# EAGLE design ardunio_breakout (EAGLE 6.4)
AUTHOR: Pat Pannuto; REV: A; TITLE: Signpost Arduino Breakout
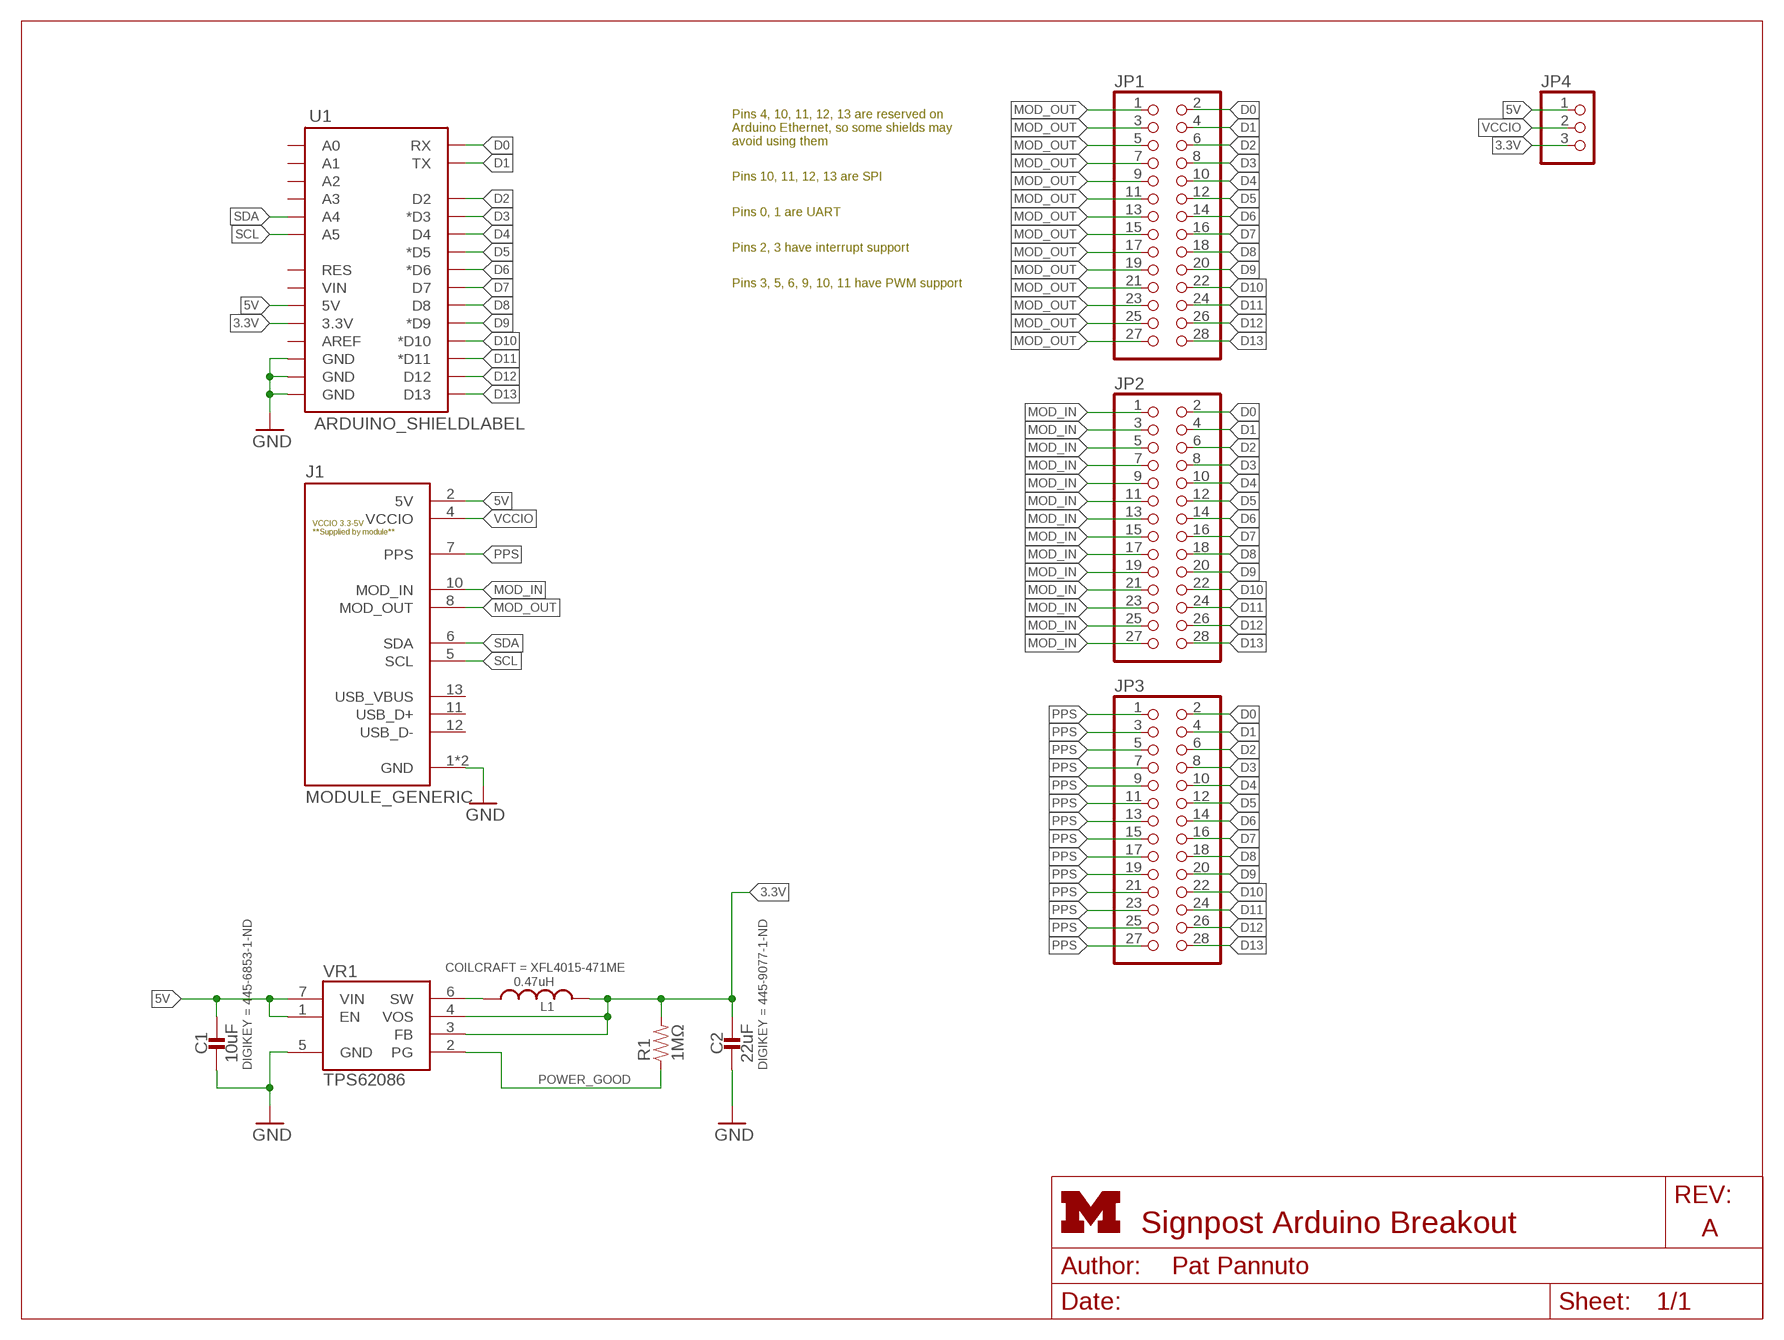
[diagram p0: schematic, sheet 1]
FRAME1 (LETTER_L_UMICH): HEIGHT: 8.5in; WIDTH: 11in

## Parts
C1  10uF  CAPACITOR0603_CAP  [0603_CAP]
C2  22uF  CAPACITOR0603_CAP  [0603_CAP]
J1  MODULE_GENERIC  [MODULE_GENERIC]
JP1  PINHD-2X14  [2X14]
JP2  PINHD-2X14  [2X14]
JP3  PINHD-2X14  [2X14]
JP4  PINHD-1X3  [1X03]
L1  0.47uH  INDUCTORXFL4015  [XFL4015]
R1  1MΩ  RESISTOR0603_RES  [0603-RES]
U1  ARDUINO_SHIELDLABEL  [DUEMILANOVE_SHIELD]
VR1  TPS62086  [RLT0007A]

## Nets
3.3V: C2.1 JP4.3 L1.2 R1.2 U1.3.3V VR1.3(FB) VR1.4(VOS)
5V: C1.1 J1.2(5V) JP4.1 U1.5V VR1.1(EN) VR1.7(VIN)
D0: JP1.2 JP2.2 JP3.2 U1.RX
D1: JP1.4 JP2.4 JP3.4 U1.TX
D2: JP1.6 JP2.6 JP3.6 U1.D2
D3: JP1.8 JP2.8 JP3.8 U1.D3(*D3)
D4: JP1.10 JP2.10 JP3.10 U1.D4
D5: JP1.12 JP2.12 JP3.12 U1.D5(*D5)
D6: JP1.14 JP2.14 JP3.14 U1.D6(*D6)
D7: JP1.16 JP2.16 JP3.16 U1.D7
D8: JP1.18 JP2.18 JP3.18 U1.D8
D9: JP1.20 JP2.20 JP3.20 U1.D9(*D9)
D10: JP1.22 JP2.22 JP3.22 U1.D10(*D10)
D11: JP1.24 JP2.24 JP3.24 U1.D11(*D11)
D12: JP1.26 JP2.26 JP3.26 U1.D12
D13: JP1.28 JP2.28 JP3.28 U1.D13
GND: C1.2 C2.2 J1.1(GND) J1.14(GND) U1.GND@0(GND) U1.GND@1(GND) U1.GND@2(GND) VR1.5(GND)
MOD_IN: J1.10(MOD_IN) JP2.1
MOD_OUT: J1.8(MOD_OUT) JP1.1 JP1.3 JP1.5 JP1.7 JP1.9 JP1.11 JP1.13 JP1.15 JP1.17 JP1.19 JP1.21 JP1.23 JP1.25 JP1.27
N$1: L1.1 VR1.6(SW)
POWER_GOOD: R1.1 VR1.2(PG)
PPS: J1.7(PPS) JP3.1
SCL: J1.5(SCL) U1.A5
SDA: J1.6(SDA) U1.A4
VCCIO: J1.4(VCCIO) JP4.2
Unconnected: J1.11(USB_D+) J1.12(USB_D-) J1.13(USB_VBUS) JP2.3 JP2.5 JP2.7 JP2.9 JP2.11 JP2.13 JP2.15 JP2.17 JP2.19 JP2.21 JP2.23 JP2.25 JP2.27 JP3.3 JP3.5 JP3.7 JP3.9 JP3.11 JP3.13 JP3.15 JP3.17 JP3.19 JP3.21 JP3.23 JP3.25 JP3.27 U1.A0 U1.A1 U1.A2 U1.A3 U1.AREF U1.RES U1.VIN

## Notes on the sheet
- Pins 4, 10, 11, 12, 13 are reserved on
  Arduino Ethernet, so some shields may
  avoid using them
- Pins 10, 11, 12, 13 are SPI
- Pins 0, 1 are UART
- Pins 2, 3 have interrupt support
- Pins 3, 5, 6, 9, 10, 11 have PWM support

## Library data of the parts
C1 = passives:CAPACITOR: 0402 Capacitor; DIGIKEY: 445-6853-1-ND
C2 = passives:CAPACITOR: 0402 Capacitor; DIGIKEY: 445-9077-1-ND
J1 = signpost:MODULE_GENERIC: Module header and PCB guildes for signposts; DIGIKEY: S9170-ND
JP1-JP3 = pinhead:PINHD-2X14: PIN HEADER
JP4 = pinhead:PINHD-1X3: PIN HEADER
L1 = passives:INDUCTOR: A very specific inductor; COILCRAFT: XFL4015-471ME
R1 = passives:RESISTOR: Resistor Basic schematic elements and footprints for 0603, 1206, and PTH resistors.
U1 = SparkFun-Boards:ARDUINO_SHIELD: Arduino shield footprint
VR1 = regulators:TPS62086: Buck Switching Regulator IC Positive Fixed 3.3V 1 Output 3A 7-VFDFN; DIGIKEY: 296-40831-1-ND

## Board
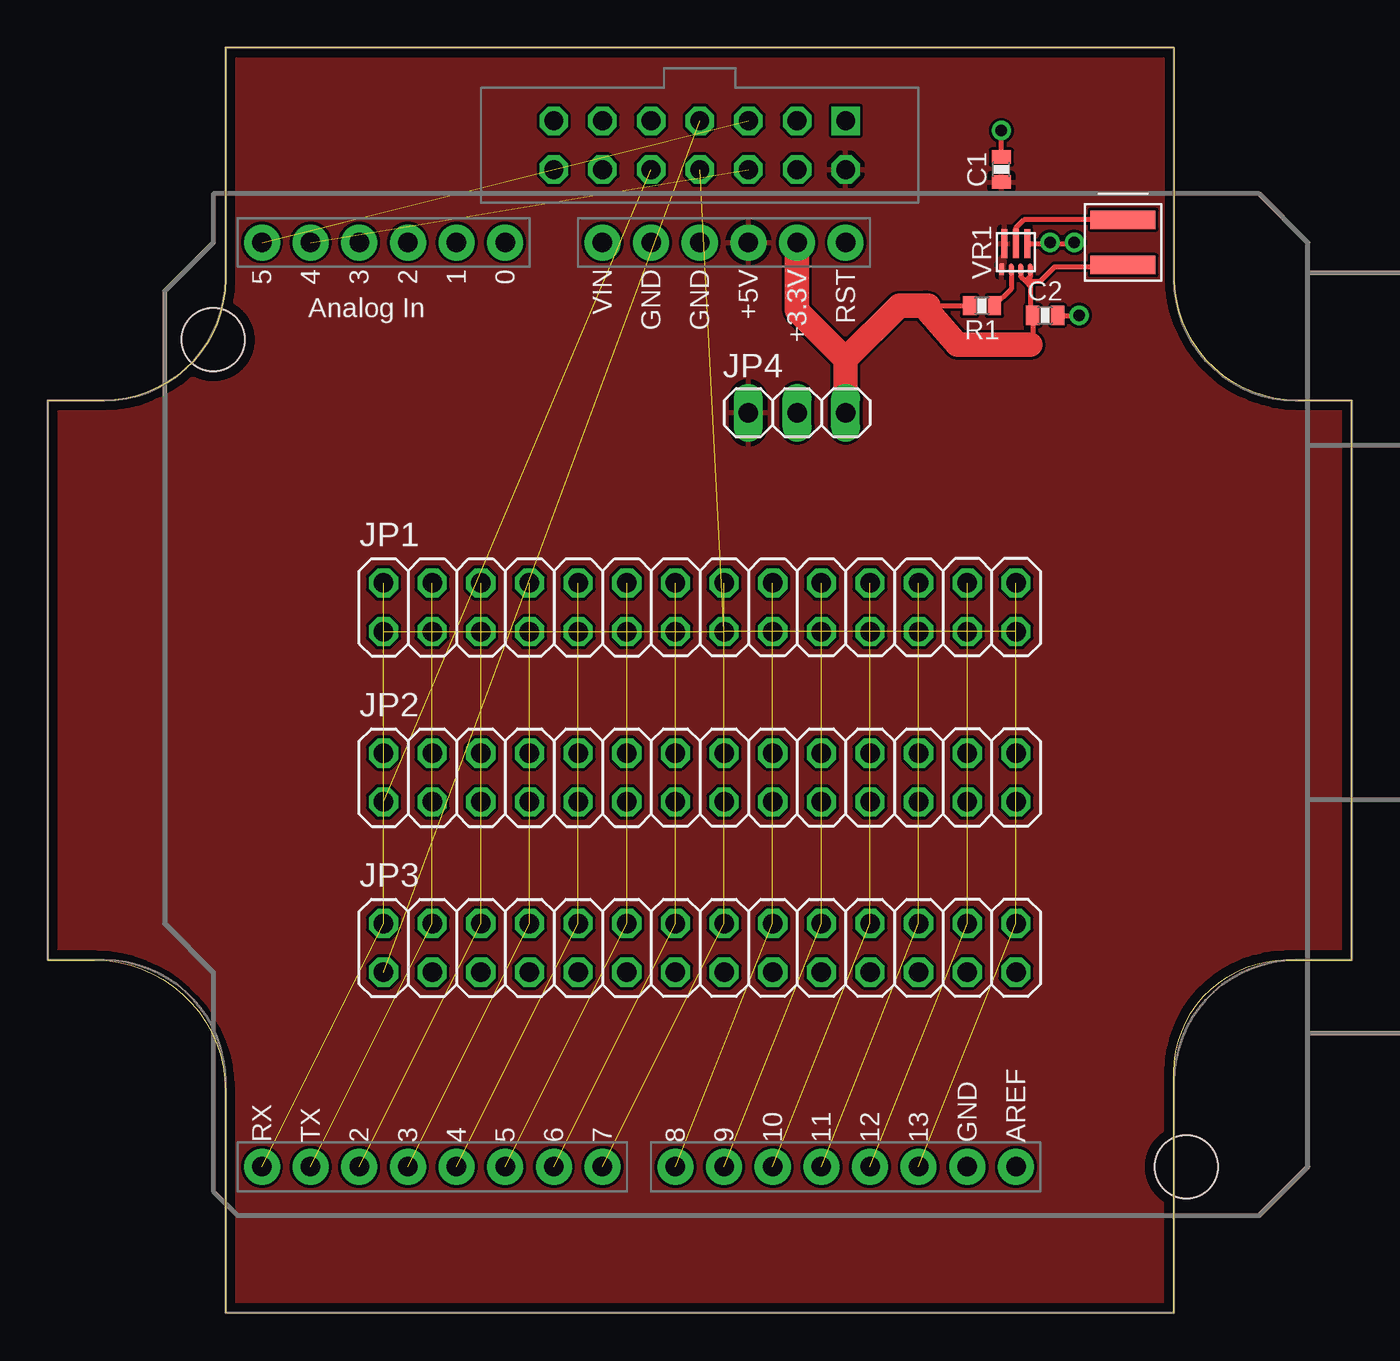
[diagram p1: board, top side]
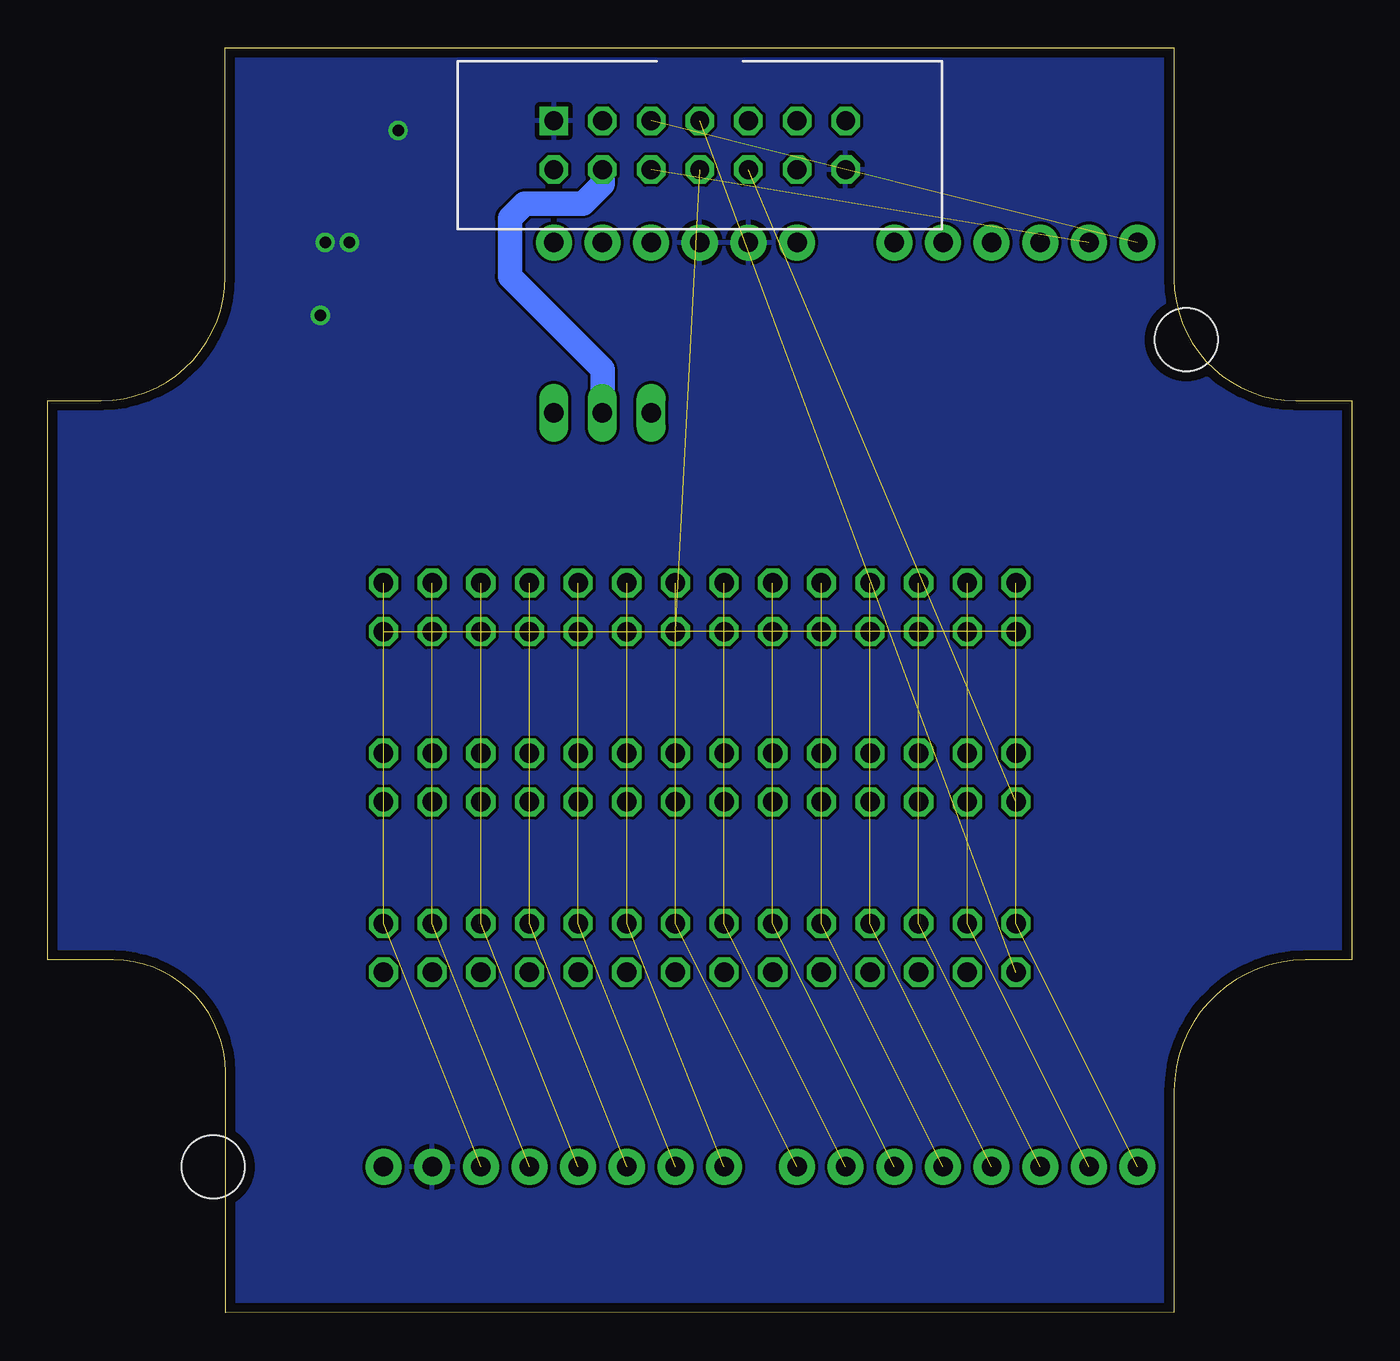
[diagram p2: board, bottom side, seen from below]

Size 68.07 x 66.04 mm. Coordinates in mm from the lower left corner, seen from the top.
Outline: 58.8,0 58.8,12.56 arc-90 64.66,18.41 68.07,18.41 68.07,47.62 65.28,47.62 arc-90 58.81,54.1 58.81,66.04 9.27,66.04 9.27,53.98 arc-90 2.92,47.62 0,47.62 0,18.41 2.43,18.41 arc-90 9.27,11.58 9.27,0.03 58.8,0
Copper layers (1*16): Top 0.0178mm / dielectric 59mil / Bottom 0.0178mm
Design rules "sunstone-2lyr_v1.0.0.3": minimum track width 6mil, minimum drill 14mil, track to track 6mil, track to pad 6mil, pad to pad 6mil, via to via 6mil, smd to smd 6mil, copper to edge 20mil, drill to drill 16mil, minimum pad ring 8mil, minimum via ring 8mil, stop-mask expansion 3mil, vias tented up to drill 50mil, thermal gap 10mil

### Footprints (pad centres in the part's own frame; a part is rotated, then mirrored left to right if it is on the bottom)
0603_CAP = smd 0.7 x 1: 1 -0.65,0; 2 0.65,0
MODULE_GENERIC = drill 0.991 square: 1 7.62,29.21 | drill 0.991 octagon: 2 7.62,26.67; 3 5.08,29.21; 4 5.08,26.67; 5 2.54,29.21; 6 2.54,26.67; 7 0,29.21; 8 0,26.67; 9 -2.54,29.21; 10 -2.54,26.67; 11 -5.08,29.21; 12 -5.08,26.67; 13 -7.62,29.21; 14 -7.62,26.67
2X14 = drill 1.016 octagon: 1 -16.51,-1.27; 2 -16.51,1.27; 3 -13.97,-1.27; 4 -13.97,1.27; 5 -11.43,-1.27; 6 -11.43,1.27; 7 -8.89,-1.27; 8 -8.89,1.27; 9 -6.35,-1.27; 10 -6.35,1.27; 11 -3.81,-1.27; 12 -3.81,1.27; 13 -1.27,-1.27; 14 -1.27,1.27; 15 1.27,-1.27; 16 1.27,1.27; 17 3.81,-1.27; 18 3.81,1.27; 19 6.35,-1.27; 20 6.35,1.27; 21 8.89,-1.27; 22 8.89,1.27; 23 11.43,-1.27; 24 11.43,1.27; 25 13.97,-1.27; 26 13.97,1.27; 27 16.51,-1.27; 28 16.51,1.27
1X03 = drill 1.016 long: 1 -2.54,0; 2 0,0; 3 2.54,0
XFL4015 = smd 0.965 x 3.404: 1 -1.181,0; 2 1.181,0
0603-RES = smd 0.7 x 1: 1 -0.65,0; 2 0.65,0
DUEMILANOVE_SHIELD = drill 1.016 pad 1.88: 3.3V 50.8,26.67; 5V 50.8,29.21; A0 50.8,41.91; A1 50.8,44.45; A2 50.8,46.99; A3 50.8,49.53; A4 50.8,52.07; A5 50.8,54.61; AREF 2.54,15.24; D2 2.54,49.53; D3 2.54,46.99; D4 2.54,44.45; D5 2.54,41.91; D6 2.54,39.37; D7 2.54,36.83; D8 2.54,33.02; D9 2.54,30.48; D10 2.54,27.94; D11 2.54,25.4; D12 2.54,22.86; D13 2.54,20.32; GND@0 50.8,31.75; GND@1 50.8,34.29; GND@2 2.54,17.78; RES 50.8,24.13; RX 2.54,54.61; TX 2.54,52.07; VIN 50.8,36.83 | hole 3.302: 45.72,57.15; 2.54,6.35
RLT0007A = smd 0.6 x 0.25: 1 -0.9,0.75; 2 -0.9,0.25; 3 -0.9,-0.25; 4 -0.9,-0.75 | smd 1.5 x 0.3: 5 0.45,-0.6; 6 0.45,0; 7 0.45,0.6

### Placement (x,y rotation side)
C1  49.78,59.69 90 top
C2  52.07,52.07 0 top
J1  34.04,33.02 0 top
JP1  34.04,36.83 0 top
JP2  34.04,27.94 0 top
JP3  34.04,19.05 0 top
JP4  39.12,46.99 0 top
L1  56.13,55.88 270 top
R1  48.77,52.58 180 top
U1  65.79,5.08 90 top
VR1  50.55,55.37 90 top

### Tracks (layer width: path | path; a pad name or v marks a point on that pad's centre or on a via)
3.3V
  Top 0.254: VR1.3 50.8,54.11 51.05,53.85 | VR1.4 51.3,54.09 51.05,53.85 | 51.05,53.85 51.82,53.85 52.58,54.61 56.05,54.61 L1.2 | 51.05,53.85 51.31,53.59 51.31,52.18 C2.1 51.42,50.66 51.31,50.55 | 45.97,52.58 R1.2
  Top 1.27: JP4.3 41.66,49.78 | 41.66,49.78 39.12,52.32 U1.3.3V | 41.66,49.78 44.45,52.58 45.72,52.58 | 45.97,52.58 45.72,52.58 | 45.72,52.58 47.5,50.55 51.31,50.55
5V
  pour Top: -0.76,-0.76 -0.76,67.56 68.58,67.56 68.58,-0.76
D0  (3 unrouted)
D1  (3 unrouted)
D2  (3 unrouted)
D3  (3 unrouted)
D4  (3 unrouted)
D5  (3 unrouted)
D6  (3 unrouted)
D7  (3 unrouted)
D8  (3 unrouted)
D9  (3 unrouted)
D10  (3 unrouted)
D11  (3 unrouted)
D12  (3 unrouted)
D13  (3 unrouted)
GND  (via drill 0.6)
  Top 0.254: C1.2 v49.78,61.72 | v52.32,55.88 52.27,55.82 VR1.5 53.54,55.82 v53.59,55.88 | C2.2 v53.85,52.07
  pour Bottom: -0.25,0 -0.25,68.33 69.34,68.33 69.34,0
MOD_IN  (1 unrouted)
MOD_OUT  (14 unrouted)
N$1
  Top 0.254: VR1.6 50.55,56.64 50.97,57.06 L1.1
POWER_GOOD
  Top 0.254: VR1.2 50.3,53.46 R1.1
PPS  (1 unrouted)
SCL  (1 unrouted)
SDA  (1 unrouted)
VCCIO
  Bottom 1.27: J1.4 39.12,58.93 40.13,57.91 43.18,57.91 43.94,57.15 43.94,54.1 39.12,49.28 JP4.2